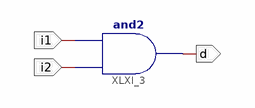
[diagram p0: schematic sheet 1]
// Xilinx ISE schematic and_gate.sch (spartan3e) as structural Verilog: 1 symbols, 3 ports
module and_gate (
  input  i1,
  input  i2,
  output d
);

  and XLXI_3 (d, i1, i2);
endmodule
